# EAGLE schematic ecocar_CVM_V2 (EAGLE 7.7.0)
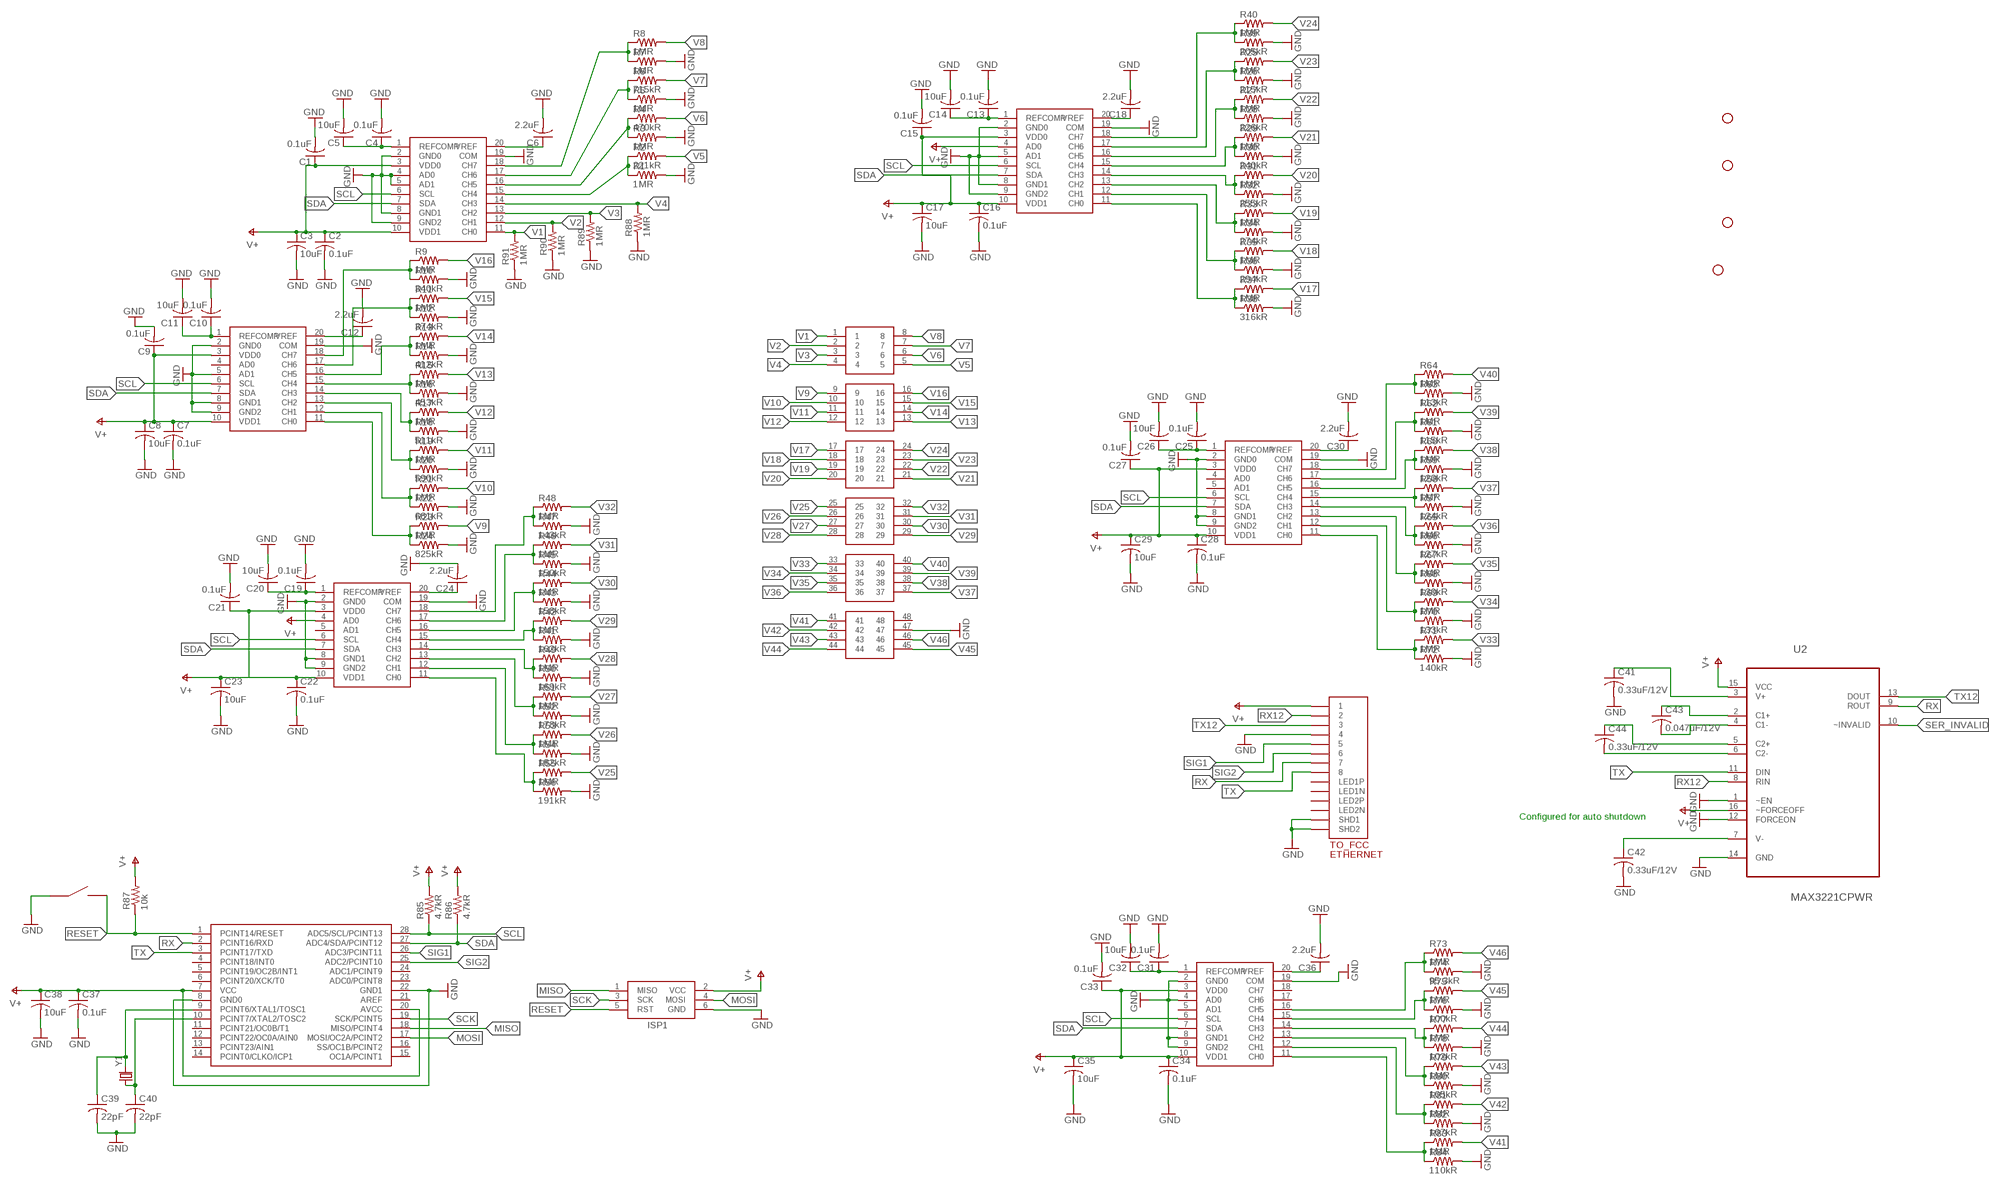
[diagram p0: schematic, sheet 1]

## Parts
0001000  LTC2309  LTC2309HF#PBF  [TSSOP20]
0001001  LTC2309  LTC2309HF#PBF  [TSSOP20]
0001010  LTC2309  LTC2309HF#PBF  [TSSOP20]
0001011  LTC2309  LTC2309HF#PBF  [TSSOP20]
0011000  LTC2309  LTC2309HF#PBF  [TSSOP20]
0011001  LTC2309  LTC2309HF#PBF  [TSSOP20]
C1  0.1uF  C-USC0805  [C0805]
C2  0.1uF  C-USC0805  [C0805]
C3  10uF  C-USC0805  [C0805]
C4  0.1uF  C-USC0805  [C0805]
C5  10uF  C-USC0805  [C0805]
C6  2.2uF  C-USC0805  [C0805]
C7  0.1uF  C-USC0805  [C0805]
C8  10uF  C-USC0805  [C0805]
C9  0.1uF  C-USC0805  [C0805]
C10  0.1uF  C-USC0805  [C0805]
C11  10uF  C-USC0805  [C0805]
C12  2.2uF  C-USC0805  [C0805]
C13  0.1uF  C-USC0805  [C0805]
C14  10uF  C-USC0805  [C0805]
C15  0.1uF  C-USC0805  [C0805]
C16  0.1uF  C-USC0805  [C0805]
C17  10uF  C-USC0805  [C0805]
C18  2.2uF  C-USC0805  [C0805]
C19  0.1uF  C-USC0805  [C0805]
C20  10uF  C-USC0805  [C0805]
C21  0.1uF  C-USC0805  [C0805]
C22  0.1uF  C-USC0805  [C0805]
C23  10uF  C-USC0805  [C0805]
C24  2.2uF  C-USC0805  [C0805]
C25  0.1uF  C-USC0805  [C0805]
C26  10uF  C-USC0805  [C0805]
C27  0.1uF  C-USC0805  [C0805]
C28  0.1uF  C-USC0805  [C0805]
C29  10uF  C-USC0805  [C0805]
C30  2.2uF  C-USC0805  [C0805]
C31  0.1uF  C-USC0805  [C0805]
C32  10uF  C-USC0805  [C0805]
C33  0.1uF  C-USC0805  [C0805]
C34  0.1uF  C-USC0805  [C0805]
C35  10uF  C-USC0805  [C0805]
C36  2.2uF  C-USC0805  [C0805]
C37  0.1uF  C-USC0805  [C0805]
C38  10uF  C-USC0805  [C0805]
C39  22pF  C-USC0805  [C0805]
C40  22pF  C-USC0805  [C0805]
C41  0.33uF/12V  C-USC0805  [C0805]
C42  0.33uF/12V  C-USC0805  [C0805]
C43  0.047uF/12V  C-USC0805  [C0805]
C44  0.33uF/12V  C-USC0805  [C0805]
ISP1  AVRISP-BOX  [AVRISP-BOX]
R1  1MR  R-US_R0805  [R0805]
R2  221kR  R-US_R0805  [R0805]
R3  1MR  R-US_R0805  [R0805]
R4  470kR  R-US_R0805  [R0805]
R5  1MR  R-US_R0805  [R0805]
R6  715kR  R-US_R0805  [R0805]
R7  1MR  R-US_R0805  [R0805]
R8  1MR  R-US_R0805  [R0805]
R9  1MR  R-US_R0805  [R0805]
R10  340kR  R-US_R0805  [R0805]
R11  1MR  R-US_R0805  [R0805]
R12  374kR  R-US_R0805  [R0805]
R13  1MR  R-US_R0805  [R0805]
R14  412kR  R-US_R0805  [R0805]
R15  1MR  R-US_R0805  [R0805]
R16  453kR  R-US_R0805  [R0805]
R17  1MR  R-US_R0805  [R0805]
R18  511kR  R-US_R0805  [R0805]
R19  1MR  R-US_R0805  [R0805]
R20  590kR  R-US_R0805  [R0805]
R21  1MR  R-US_R0805  [R0805]
R22  681kR  R-US_R0805  [R0805]
R23  1MR  R-US_R0805  [R0805]
R24  825kR  R-US_R0805  [R0805]
R25  1MR  R-US_R0805  [R0805]
R26  215kR  R-US_R0805  [R0805]
R27  1MR  R-US_R0805  [R0805]
R28  226kR  R-US_R0805  [R0805]
R29  1MR  R-US_R0805  [R0805]
R30  240kR  R-US_R0805  [R0805]
R31  1MR  R-US_R0805  [R0805]
R32  255kR  R-US_R0805  [R0805]
R33  1MR  R-US_R0805  [R0805]
R34  274kR  R-US_R0805  [R0805]
R35  1MR  R-US_R0805  [R0805]
R36  294kR  R-US_R0805  [R0805]
R37  1MR  R-US_R0805  [R0805]
R38  316kR  R-US_R0805  [R0805]
R39  205kR  R-US_R0805  [R0805]
R40  1MR  R-US_R0805  [R0805]
R41  162kR  R-US_R0805  [R0805]
R42  1MR  R-US_R0805  [R0805]
R43  158kR  R-US_R0805  [R0805]
R44  1MR  R-US_R0805  [R0805]
R45  150kR  R-US_R0805  [R0805]
R46  1MR  R-US_R0805  [R0805]
R47  143kR  R-US_R0805  [R0805]
R48  1MR  R-US_R0805  [R0805]
R49  1MR  R-US_R0805  [R0805]
R50  169kR  R-US_R0805  [R0805]
R51  1MR  R-US_R0805  [R0805]
R52  178kR  R-US_R0805  [R0805]
R53  1MR  R-US_R0805  [R0805]
R54  182kR  R-US_R0805  [R0805]
R55  1MR  R-US_R0805  [R0805]
R56  191kR  R-US_R0805  [R0805]
R57  124kR  R-US_R0805  [R0805]
R58  1MR  R-US_R0805  [R0805]
R59  120kR  R-US_R0805  [R0805]
R60  1MR  R-US_R0805  [R0805]
R61  115kR  R-US_R0805  [R0805]
R62  1MR  R-US_R0805  [R0805]
R63  113kR  R-US_R0805  [R0805]
R64  1MR  R-US_R0805  [R0805]
R65  1MR  R-US_R0805  [R0805]
R66  127kR  R-US_R0805  [R0805]
R67  1MR  R-US_R0805  [R0805]
R68  130kR  R-US_R0805  [R0805]
R69  1MR  R-US_R0805  [R0805]
R70  133kR  R-US_R0805  [R0805]
R71  1MR  R-US_R0805  [R0805]
R72  140kR  R-US_R0805  [R0805]
R73  1MR  R-US_R0805  [R0805]
R74  95.3kR  R-US_R0805  [R0805]
R75  1MR  R-US_R0805  [R0805]
R76  100kR  R-US_R0805  [R0805]
R77  1MR  R-US_R0805  [R0805]
R78  102kR  R-US_R0805  [R0805]
R79  1MR  R-US_R0805  [R0805]
R80  105kR  R-US_R0805  [R0805]
R81  1MR  R-US_R0805  [R0805]
R82  107kR  R-US_R0805  [R0805]
R83  1MR  R-US_R0805  [R0805]
R84  110kR  R-US_R0805  [R0805]
R85  4.7kR  R-US_R0805  [R0805]
R86  4.7kR  R-US_R0805  [R0805]
R87  10k  R-US_R0805  [R0805]
R88  1MR  R-US_R0805  [R0805]
R89  1MR  R-US_R0805  [R0805]
R90  1MR  R-US_R0805  [R0805]
R91  1MR  R-US_R0805  [R0805]
RESET_BTN  EG4621CT-ND  [EG4621CT-ND]
STANDOFF1  STAND-OFF  [STAND-OFF]
STANDOFF2  STAND-OFF  [STAND-OFF]
STANDOFF3  STAND-OFF  [STAND-OFF]
STANDOFF4  STAND-OFF  [STAND-OFF]
TO_FCC  ETHERNET  [A122645-ND]
U2  MAX3221CPWR  [SOP65P640X120-16N]
U$1  ATMEGA328P  [DIL28-3]
U$3  6-RJ45  6-RJ45-5557572-3  [48-PIN-THROUGHHOLE]
Y1  CRYSTALHC49US  [HC49US]

## Nets
GND: 0001000.2(GND0) 0001000.4(AD0) 0001000.5(AD1) 0001000.8(GND1) 0001000.9(GND2) 0001000.19(COM) 0001001.2(GND0) 0001001.5(AD1) 0001001.8(GND1) 0001001.9(GND2) 0001001.19(COM) 0001010.2(GND0) 0001010.5(AD1) 0001010.8(GND1) 0001010.9(GND2) 0001010.19(COM) 0001011.2(GND0) 0001011.8(GND1) 0001011.9(GND2) 0001011.19(COM) 0011000.2(GND0) 0011000.8(GND1) 0011000.9(GND2) 0011000.19(COM) 0011001.2(GND0) 0011001.4(AD0) 0011001.8(GND1) 0011001.9(GND2) 0011001.19(COM) C1.2 C2.2 C3.2 C4.2 C5.2 C6.2 C7.2 C8.2 C9.2 C10.2 C11.2 C12.2 C13.2 C14.2 C15.2 C16.2 C17.2 C18.2 C19.2 C20.2 C21.2 C22.2 C23.2 C24.2 C25.2 C26.2 C27.2 C28.2 C29.2 C30.2 C31.2 C32.2 C33.2 C34.2 C35.2 C36.2 C37.2 C38.2 C39.2 C40.2 C41.2 C42.2 ISP1.6(GND) R1.2 R3.2 R5.2 R7.2 R10.2 R12.2 R14.2 R16.2 R18.2 R20.2 R22.2 R24.2 R26.2 R28.2 R30.2 R32.2 R34.2 R36.2 R38.2 R39.2 R41.2 R43.2 R45.2 R47.2 R50.2 R52.2 R54.2 R56.2 R57.2 R59.2 R61.2 R63.2 R66.2 R68.2 R70.2 R72.2 R74.2 R76.2 R78.2 R80.2 R82.2 R84.2 R88.1 R89.1 R90.1 R91.1 RESET_BTN.P$1 RESET_BTN.P$2 TO_FCC.P$4 TO_FCC.P$13(SHD1) TO_FCC.P$14(SHD2) U2.1(~EN) U2.12(FORCEON) U2.14(GND) U$1.8(GND0) U$1.22(GND1) U$3.47
MISO: ISP1.1(MISO) U$1.18(MISO/PCINT4)
MOSI: ISP1.4(MOSI) U$1.17(MOSI/OC2A/PCINT2)
N$1: 0001000.1(REFCOMP) C4.1 C5.1
N$2: 0001000.20(VREF) C6.1
N$3: 0001001.11(CH0) R23.1 R24.1
N$4: 0001001.1(REFCOMP) C10.1 C11.1
N$5: 0001001.20(VREF) C12.1
N$6: 0001001.12(CH1) R21.1 R22.1
N$7: 0001000.15(CH4) R1.1 R2.1
N$8: 0001000.16(CH5) R3.1 R4.1
N$9: 0001000.17(CH6) R5.1 R6.1
N$10: 0001000.18(CH7) R7.1 R8.1
N$11: 0001001.13(CH2) R19.1 R20.1
N$12: 0001001.14(CH3) R17.1 R18.1
N$13: 0001001.15(CH4) R15.1 R16.1
N$14: 0001001.16(CH5) R13.1 R14.1
N$15: 0001001.17(CH6) R11.1 R12.1
N$16: 0001001.18(CH7) R9.1 R10.1
N$17: 0001010.1(REFCOMP) C13.1 C14.1
N$18: 0011000.1(REFCOMP) C25.1 C26.1
N$19: 0001010.11(CH0) R37.1 R38.1
N$20: 0001010.20(VREF) C18.1
N$21: 0001010.12(CH1) R35.1 R36.1
N$22: 0001010.13(CH2) R33.1 R34.1
N$23: 0001010.14(CH3) R31.1 R32.1
N$24: 0001010.15(CH4) R29.1 R30.1
N$25: 0001010.16(CH5) R27.1 R28.1
N$26: 0001010.17(CH6) R25.1 R26.1
N$27: 0001010.18(CH7) R39.1 R40.1
N$28: 0001011.1(REFCOMP) C19.1 C20.1
N$29: 0011001.1(REFCOMP) C31.1 C32.1
N$30: 0011001.20(VREF) C36.1
N$31: 0001011.20(VREF) C24.1
N$32: 0001011.11(CH0) R55.1 R56.1
N$33: 0001011.12(CH1) R53.1 R54.1
N$34: 0001011.13(CH2) R51.1 R52.1
N$35: 0001011.14(CH3) R49.1 R50.1
N$36: 0001011.15(CH4) R41.1 R42.1
N$37: 0001011.16(CH5) R43.1 R44.1
N$38: 0001011.17(CH6) R45.1 R46.1
N$39: 0001011.18(CH7) R47.1 R48.1
N$40: 0011000.20(VREF) C30.1
N$41: 0011000.11(CH0) R71.1 R72.1
N$42: 0011000.12(CH1) R69.1 R70.1
N$43: 0011000.13(CH2) R67.1 R68.1
N$44: 0011000.14(CH3) R65.1 R66.1
N$45: 0011000.15(CH4) R57.1 R58.1
N$46: 0011000.16(CH5) R59.1 R60.1
N$47: 0011000.17(CH6) R61.1 R62.1
N$48: 0011000.18(CH7) R63.1 R64.1
N$49: C39.1 U$1.9(PCINT6/XTAL1/TOSC1) Y1.2
N$50: C40.1 U$1.10(PCINT7/XTAL2/TOSC2) Y1.1
N$51: 0011001.11(CH0) R83.1 R84.1
N$52: 0011001.12(CH1) R81.1 R82.1
N$53: 0011001.13(CH2) R79.1 R80.1
N$54: 0011001.14(CH3) R77.1 R78.1
N$55: 0011001.15(CH4) R75.1 R76.1
N$56: 0011001.16(CH5) R73.1 R74.1
N$73: C41.1 U2.3(V+)
N$74: C43.1 U2.2(C1+)
N$75: C43.2 U2.4(C1-)
N$76: C44.1 U2.5(C2+)
N$77: C44.2 U2.6(C2-)
N$78: C42.1 U2.7(V-)
RESET: ISP1.5(RST) R87.1 RESET_BTN.P$3 RESET_BTN.P$4 U$1.1(PCINT14/RESET)
RX: TO_FCC.P$7 U2.9(ROUT) U$1.2(PCINT16/RXD)
RX12: TO_FCC.P$2 U2.8(RIN)
SCK: ISP1.3(SCK) U$1.19(SCK/PCINT5)
SCL: 0001000.6(SCL) 0001001.6(SCL) 0001010.6(SCL) 0001011.6(SCL) 0011000.6(SCL) 0011001.6(SCL) R85.1 U$1.28(ADC5/SCL/PCINT13)
SDA: 0001000.7(SDA) 0001001.7(SDA) 0001010.7(SDA) 0001011.7(SDA) 0011000.7(SDA) 0011001.7(SDA) R86.1 U$1.27(ADC4/SDA/PCINT12)
SER_INVALID: U2.10(~INVALID)
SIG1: TO_FCC.P$5 U$1.26(ADC3/PCINT11)
SIG2: TO_FCC.P$6 U$1.25(ADC2/PCINT10)
TX: TO_FCC.P$8 U2.11(DIN) U$1.3(PCINT17/TXD)
TX12: TO_FCC.P$3 U2.13(DOUT)
V1: 0001000.11(CH0) R91.2 U$3.1
V2: 0001000.12(CH1) R90.2 U$3.2
V3: 0001000.13(CH2) R89.2 U$3.3
V4: 0001000.14(CH3) R88.2 U$3.4
V5: R2.2 U$3.5
V6: R4.2 U$3.6
V7: R6.2 U$3.7
V8: R8.2 U$3.8
V9: R23.2 U$3.9
V10: R21.2 U$3.10
V11: R19.2 U$3.11
V12: R17.2 U$3.12
V13: R15.2 U$3.13
V14: R13.2 U$3.14
V15: R11.2 U$3.15
V16: R9.2 U$3.16
V17: R37.2 U$3.17
V18: R35.2 U$3.18
V19: R33.2 U$3.19
V20: R31.2 U$3.20
V21: R29.2 U$3.21
V22: R27.2 U$3.22
V23: R25.2 U$3.23
V24: R40.2 U$3.24
V25: R55.2 U$3.25
V26: R53.2 U$3.26
V27: R51.2 U$3.27
V28: R49.2 U$3.28
V29: R42.2 U$3.29
V30: R44.2 U$3.30
V31: R46.2 U$3.31
V32: R48.2 U$3.32
V33: R71.2 U$3.33
V34: R69.2 U$3.34
V35: R67.2 U$3.35
V36: R65.2 U$3.36
V37: R58.2 U$3.37
V38: R60.2 U$3.38
V39: R62.2 U$3.39
V40: R64.2 U$3.40
V41: R83.2 U$3.41
V42: R81.2 U$3.42
V43: R79.2 U$3.43
V44: R77.2 U$3.44
V45: R75.2 U$3.45
V46: R73.2 U$3.46
V+: 0001000.3(VDD0) 0001000.10(VDD1) 0001001.3(VDD0) 0001001.10(VDD1) 0001010.3(VDD0) 0001010.4(AD0) 0001010.10(VDD1) 0001011.3(VDD0) 0001011.4(AD0) 0001011.10(VDD1) 0011000.3(VDD0) 0011000.10(VDD1) 0011001.3(VDD0) 0011001.10(VDD1) C1.1 C2.1 C3.1 C7.1 C8.1 C9.1 C15.1 C16.1 C17.1 C21.1 C22.1 C23.1 C27.1 C28.1 C29.1 C33.1 C34.1 C35.1 C37.1 C38.1 ISP1.2(VCC) R85.2 R86.2 R87.2 TO_FCC.P$1 U2.15(VCC) U2.16(~FORCEOFF) U$1.7(VCC) U$1.20(AVCC)
Unconnected: 0001001.4(AD0) 0001011.5(AD1) 0011000.4(AD0) 0011000.5(AD1) 0011001.5(AD1) 0011001.17(CH6) 0011001.18(CH7) TO_FCC.P$9(LED1N) TO_FCC.P$10(LED1P) TO_FCC.P$11(LED2N) TO_FCC.P$12(LED2P) U$1.4(PCINT18/INT0) U$1.5(PCINT19/OC2B/INT1) U$1.6(PCINT20/XCK/T0) U$1.11(PCINT21/OC0B/T1) U$1.12(PCINT22/OC0A/AIN0) U$1.13(PCINT23/AIN1) U$1.14(PCINT0/CLKO/ICP1) U$1.15(OC1A/PCINT1) U$1.16(SS/OC1B/PCINT2) U$1.21(AREF) U$1.23(ADC0/PCINT8) U$1.24(ADC1/PCINT9) U$3.48

## Notes on the sheet
- Configured for auto shutdown

## Library data of the parts
0001000 0001001 0001010 0001011 0011000 0011001 = linear-technology:LTC2309HF#PBF
C1-C40 = rcl:C-US: CAPACITOR, American symbol
C41-C44 = E-P-008-R1.2:C-US: CAPACITOR, American symbol
ISP1 = adafruit:AVRISP: AVR ISP HEADER Standard 6 pin header for AVR programming
R1-R91 = rcl:R-US_: RESISTOR, American symbol
RESET_BTN = EG4621CT-ND:EG4621CT-ND: surface mount push putton digikey number EG4621CT-ND
STANDOFF1-STANDOFF4 = SparkFun-Electromechanical:STAND-OFF: #4 Stand Off This is the mechanical footprint for a #4 phillips button head screw. Use the keepout ring to avoid running the screw head into surrounding components. SKU : PRT-00447
TO_FCC = ETHERNET:ETHERNET: Ethernet port with 2 leds. digikey number A122645-ND
U2 = Texas Instruments_By_element14_Batch_1:MAX3221CPWR: RS-232 Line Driver/Receiver; MPN: MAX3221CPWR; OC_FARNELL: -; OC_NEWARK: 75C0980; PACKAGE: TSSOP-16; SUPPLIER: Texas Instruments
U$1 = atmel:ATMEGA328P
U$3 = rj45:6-RJ45-5557572-3
Y1 = SparkFun-FreqCtrl:CRYSTAL: Various standard crystals. Proven footprints.